# Altium schematic sheet 八路btn驱动.SchDoc
size A2
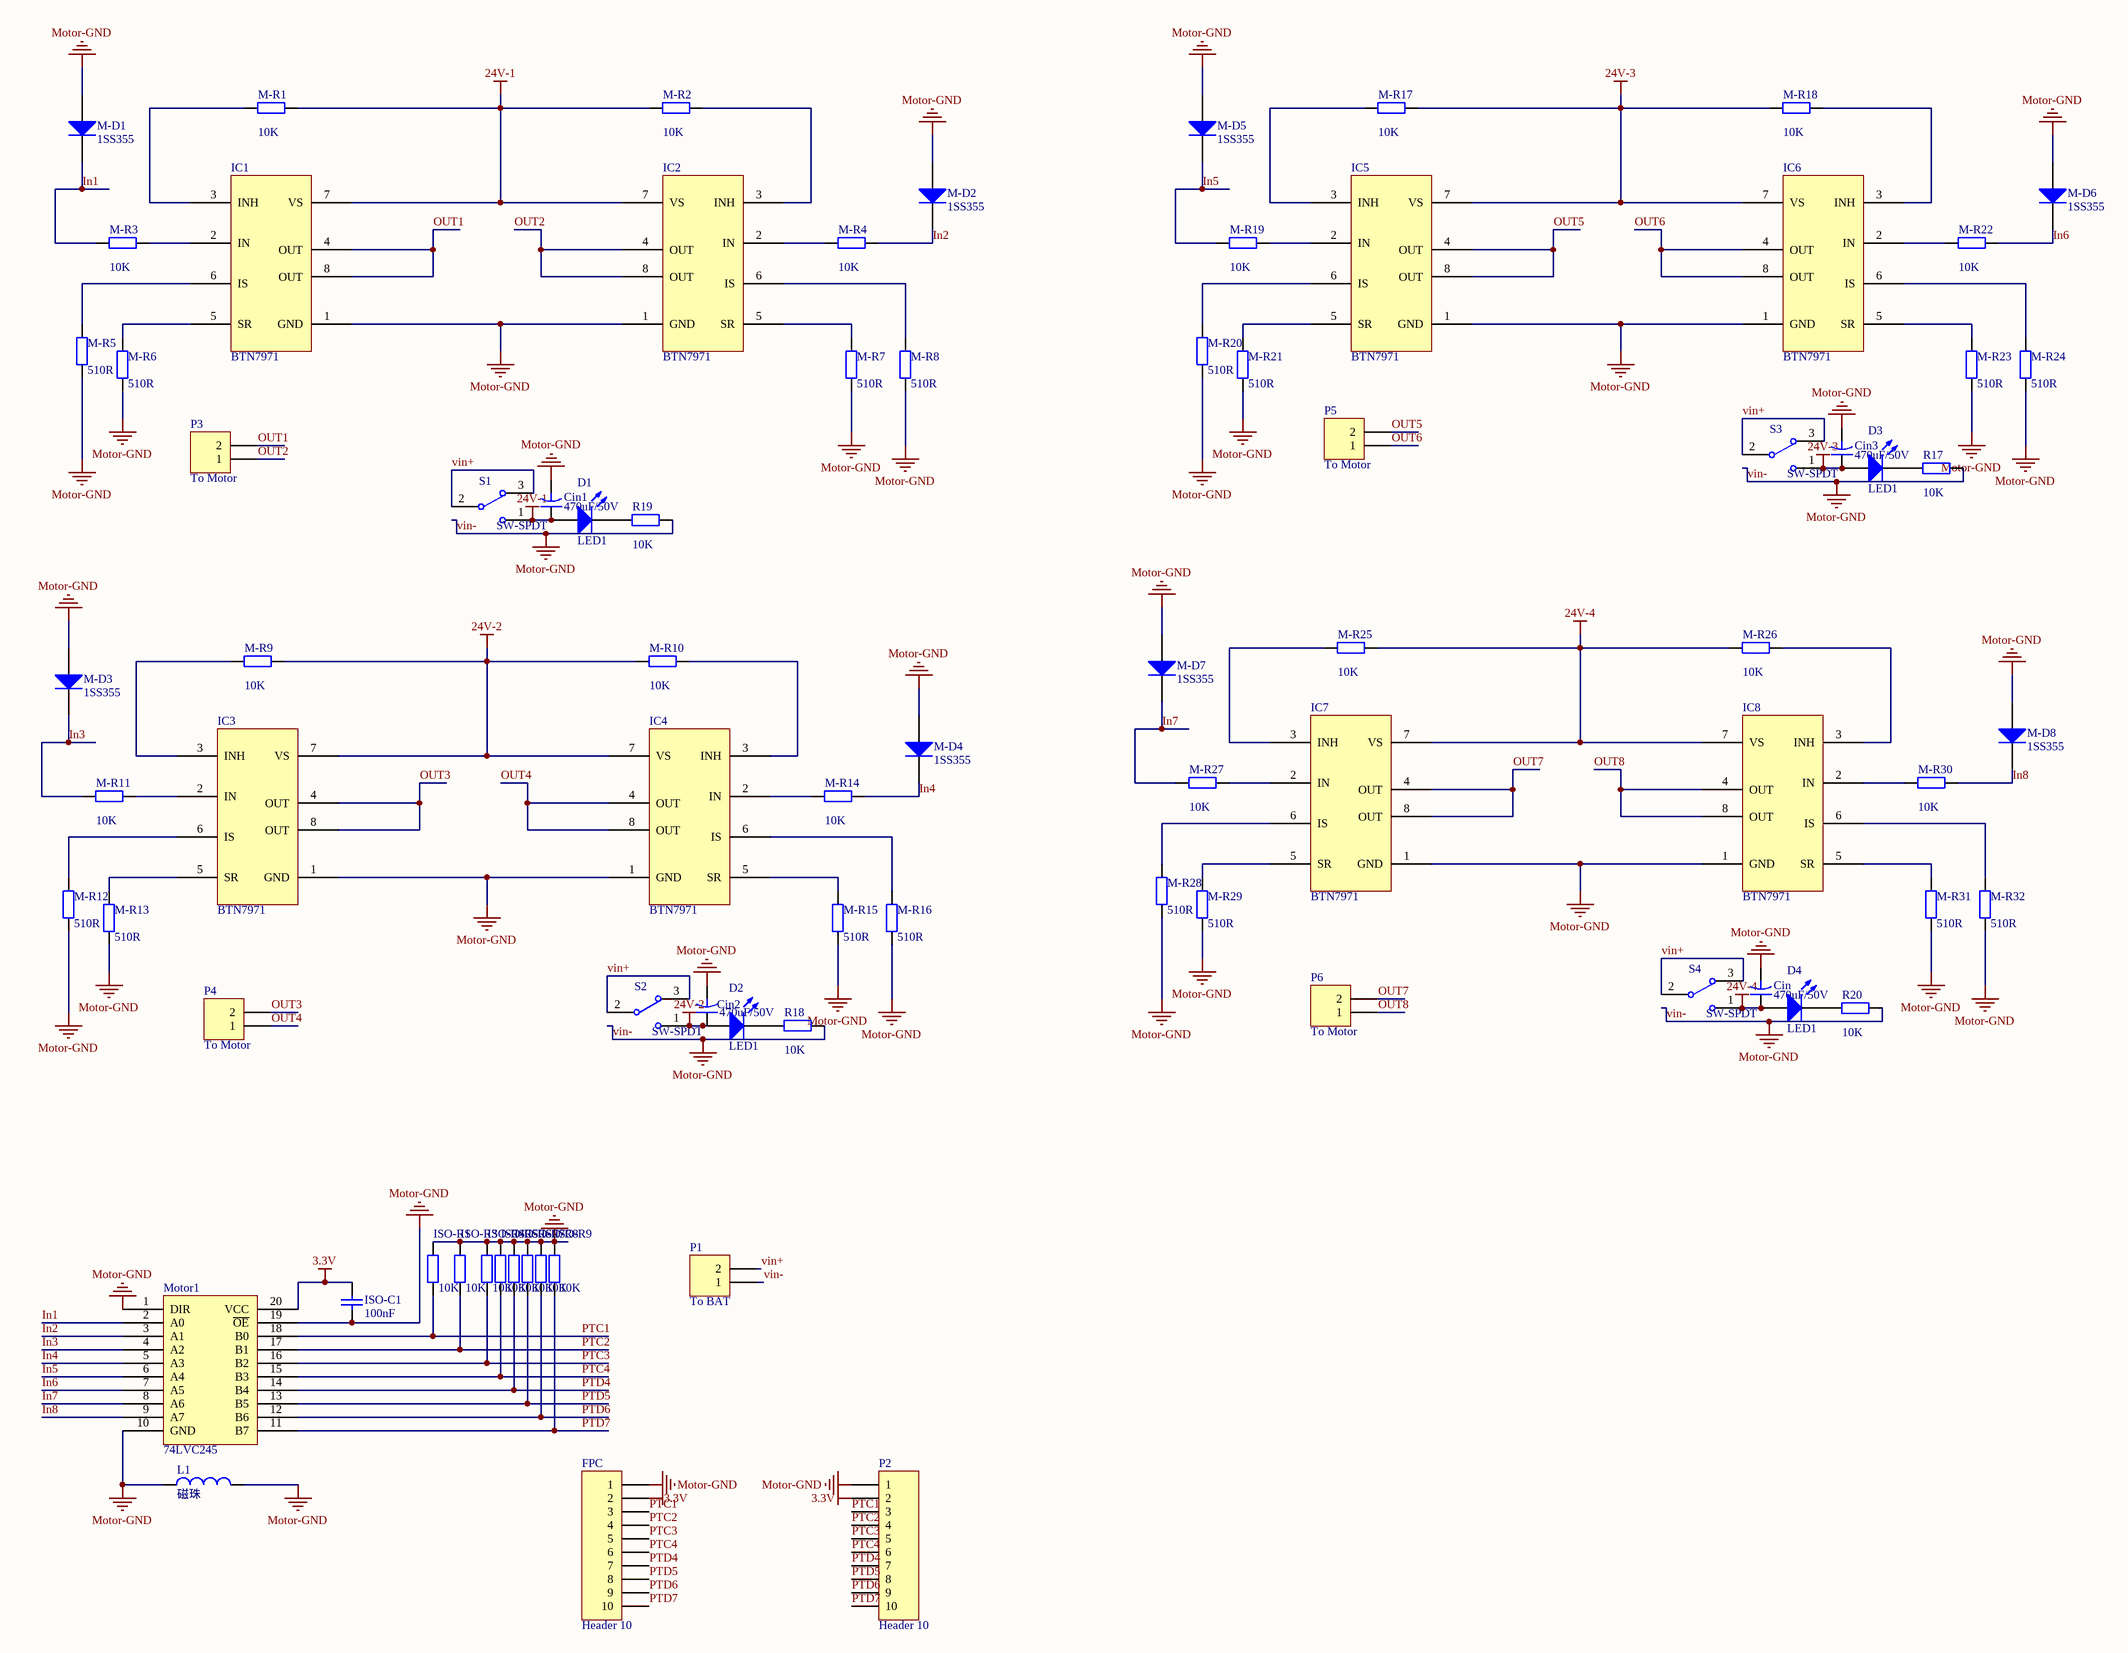
[diagram p0: 八路btn驱动.SchDoc]

## Parts
Cin  value 470uF/50V  [RB.2(10mm)]  (hidden comment: Cap2)
Cin1  value 470uF/50V  [RB.2(10mm)]  (hidden comment: Cap2)
Cin2  value 470uF/50V  [RB.2(10mm)]  (hidden comment: Cap2)
Cin3  value 470uF/50V  [RB.2(10mm)]  (hidden comment: Cap2)
D1  LED1  [LED0805G]
D2  LED1  [LED0805G]
D3  LED1  [LED0805G]
D4  LED1  [LED0805G]
FPC  Header 10  [HDR2X5]
IC1  BTN7971  [PG-TO263-7-1]
IC2  BTN7971  [PG-TO263-7-1]
IC3  BTN7971  [PG-TO263-7-1]
IC4  BTN7971  [PG-TO263-7-1]
IC5  BTN7971  [PG-TO263-7-1]
IC6  BTN7971  [PG-TO263-7-1]
IC7  BTN7971  [PG-TO263-7-1]
IC8  BTN7971  [PG-TO263-7-1]
ISO-C1  100nF  [c0805]
ISO-R1  value 10K  [c0805]  (hidden comment: Res2)
ISO-R3  value 10K  [c0805]  (hidden comment: Res2)
ISO-R4  value 10K  [c0805]  (hidden comment: Res2)
ISO-R5  value 10K  [c0805]  (hidden comment: Res2)
ISO-R6  value 10K  [c0805]  (hidden comment: Res2)
ISO-R7  value 10K  [c0805]  (hidden comment: Res2)
ISO-R8  value 10K  [c0805]  (hidden comment: Res2)
ISO-R9  value 10K  [c0805]  (hidden comment: Res2)
L1  磁珠  [c0805]
M-D1  1SS355  [SMB]
M-D2  1SS355  [SMB]
M-D3  1SS355  [SMB]
M-D4  1SS355  [SMB]
M-D5  1SS355  [SMB]
M-D6  1SS355  [SMB]
M-D7  1SS355  [SMB]
M-D8  1SS355  [SMB]
M-R1  value 10K  [0805]  (hidden comment: Res2)
M-R2  value 10K  [0805]  (hidden comment: Res2)
M-R3  value 10K  [0805]  (hidden comment: Res2)
M-R4  value 10K  [0805]  (hidden comment: Res2)
M-R5  value 510R  [0805]  (hidden comment: Res2)
M-R6  value 510R  [0805]  (hidden comment: Res2)
M-R7  value 510R  [0805]  (hidden comment: Res2)
M-R8  value 510R  [0805]  (hidden comment: Res2)
M-R9  value 10K  [0805]  (hidden comment: Res2)
M-R10  value 10K  [0805]  (hidden comment: Res2)
M-R11  value 10K  [0805]  (hidden comment: Res2)
M-R12  value 510R  [0805]  (hidden comment: Res2)
M-R13  value 510R  [0805]  (hidden comment: Res2)
M-R14  value 10K  [0805]  (hidden comment: Res2)
M-R15  value 510R  [0805]  (hidden comment: Res2)
M-R16  value 510R  [0805]  (hidden comment: Res2)
M-R17  value 10K  [0805]  (hidden comment: Res2)
M-R18  value 10K  [0805]  (hidden comment: Res2)
M-R19  value 10K  [0805]  (hidden comment: Res2)
M-R20  value 510R  [0805]  (hidden comment: Res2)
M-R21  value 510R  [0805]  (hidden comment: Res2)
M-R22  value 10K  [0805]  (hidden comment: Res2)
M-R23  value 510R  [0805]  (hidden comment: Res2)
M-R24  value 510R  [0805]  (hidden comment: Res2)
M-R25  value 10K  [0805]  (hidden comment: Res2)
M-R26  value 10K  [0805]  (hidden comment: Res2)
M-R27  value 10K  [0805]  (hidden comment: Res2)
M-R28  value 510R  [0805]  (hidden comment: Res2)
M-R29  value 510R  [0805]  (hidden comment: Res2)
M-R30  value 10K  [0805]  (hidden comment: Res2)
M-R31  value 510R  [0805]  (hidden comment: Res2)
M-R32  value 510R  [0805]  (hidden comment: Res2)
Motor1  74LVC245  [TSSOP20]
P1  To BAT  [0.5mm端子]
P2  Header 10  [FH12-10S-1SH]
P3  To Motor  [0.5mm端子]
P4  To Motor  [0.5mm端子]
P5  To Motor  [0.5mm端子]
P6  To Motor  [0.5mm端子]
R17  value 10K  [R0805]
R18  value 10K  [R0805]
R19  value 10K  [R0805]
R20  value 10K  [R0805]
S1  SW-SPDT  [switch]
S2  SW-SPDT  [switch]
S3  SW-SPDT  [switch]
S4  SW-SPDT  [switch]

## Nets
3.3V: FPC.2 ISO-C1.1 Motor1.20(VCC) P2.2
24V-1: Cin1.1 D1.1(A) IC1.7(VS) IC2.7(VS) M-R1.2 M-R2.1 S1.1
24V-2: Cin2.1 D2.1(A) IC3.7(VS) IC4.7(VS) M-R9.2 M-R10.1 S2.1
24V-3: Cin3.1 D3.1(A) IC5.7(VS) IC6.7(VS) M-R17.2 M-R18.1 S3.1
24V-4: Cin.1 D4.1(A) IC7.7(VS) IC8.7(VS) M-R25.2 M-R26.1 S4.1
vin-: Cin.2 Cin1.2 Cin2.2 Cin3.2 FPC.1 IC1.1(GND) IC2.1(GND) IC3.1(GND) IC4.1(GND) IC5.1(GND) IC6.1(GND) IC7.1(GND) IC8.1(GND) ISO-C1.2 ISO-R1.2 ISO-R3.2 ISO-R4.2 ISO-R5.2 ISO-R6.2 ISO-R7.2 ISO-R8.2 ISO-R9.2 L1.1 L1.2 M-D1.1(A) M-D2.1(A) M-D3.1(A) M-D4.1(A) M-D5.1(A) M-D6.1(A) M-D7.1(A) M-D8.1(A) M-R5.1 M-R6.1 M-R7.1 M-R8.1 M-R12.1 M-R13.1 M-R15.1 M-R16.1 M-R20.1 M-R21.1 M-R23.1 M-R24.1 M-R28.1 M-R29.1 M-R31.1 M-R32.1 Motor1.1(DIR) Motor1.10(GND) Motor1.19(~{OE}) P1.1 P2.1 R17.1 R18.1 R19.1 R20.1  [also labelled Motor-GND]
In1: M-D1.2(K) M-R3.1 Motor1.2(A0)
In2: M-D2.2(K) M-R4.2 Motor1.3(A1)
In3: M-D3.2(K) M-R11.1 Motor1.4(A2)
In4: M-D4.2(K) M-R14.2 Motor1.5(A3)
In5: M-D5.2(K) M-R19.1 Motor1.6(A4)
In6: M-D6.2(K) M-R22.2 Motor1.7(A5)
In7: M-D7.2(K) M-R27.1 Motor1.8(A6)
In8: M-D8.2(K) M-R30.2 Motor1.9(A7)
OUT1: IC1.4(OUT) IC1.8(OUT) P3.2
OUT2: IC2.4(OUT) IC2.8(OUT) P3.1
OUT3: IC3.4(OUT) IC3.8(OUT) P4.2
OUT4: IC4.4(OUT) IC4.8(OUT) P4.1
OUT5: IC5.4(OUT) IC5.8(OUT) P5.2
OUT6: IC6.4(OUT) IC6.8(OUT) P5.1
OUT7: IC7.4(OUT) IC7.8(OUT) P6.2
OUT8: IC8.4(OUT) IC8.8(OUT) P6.1
PTC1: FPC.3 ISO-R1.1 Motor1.18(B0) P2.3
PTC2: FPC.4 ISO-R3.1 Motor1.17(B1) P2.4
PTC3: FPC.5 ISO-R4.1 Motor1.16(B2) P2.5
PTC4: FPC.6 ISO-R5.1 Motor1.15(B3) P2.6
PTD4: FPC.7 ISO-R6.1 Motor1.14(B4) P2.7
PTD5: FPC.8 ISO-R7.1 Motor1.13(B5) P2.8
PTD6: FPC.9 ISO-R8.1 Motor1.12(B6) P2.9
PTD7: FPC.10 ISO-R9.1 Motor1.11(B7) P2.10
vin+: P1.2 S1.2 S1.3 S2.2 S2.3 S3.2 S3.3 S4.2 S4.3
NetD1_2: D1.2(K) R19.2
NetD2_2: D2.2(K) R18.2
NetD3_2: D3.2(K) R17.2
NetD4_2: D4.2(K) R20.2
NetIC1_2: IC1.2(IN) M-R3.2
NetIC1_3: IC1.3(INH) M-R1.1
NetIC1_5: IC1.5(SR) M-R6.2
NetIC1_6: IC1.6(IS) M-R5.2
NetIC2_2: IC2.2(IN) M-R4.1
NetIC2_3: IC2.3(INH) M-R2.2
NetIC2_5: IC2.5(SR) M-R7.2
NetIC2_6: IC2.6(IS) M-R8.2
NetIC3_2: IC3.2(IN) M-R11.2
NetIC3_3: IC3.3(INH) M-R9.1
NetIC3_5: IC3.5(SR) M-R13.2
NetIC3_6: IC3.6(IS) M-R12.2
NetIC4_2: IC4.2(IN) M-R14.1
NetIC4_3: IC4.3(INH) M-R10.2
NetIC4_5: IC4.5(SR) M-R15.2
NetIC4_6: IC4.6(IS) M-R16.2
NetIC5_2: IC5.2(IN) M-R19.2
NetIC5_3: IC5.3(INH) M-R17.1
NetIC5_5: IC5.5(SR) M-R21.2
NetIC5_6: IC5.6(IS) M-R20.2
NetIC6_2: IC6.2(IN) M-R22.1
NetIC6_3: IC6.3(INH) M-R18.2
NetIC6_5: IC6.5(SR) M-R23.2
NetIC6_6: IC6.6(IS) M-R24.2
NetIC7_2: IC7.2(IN) M-R27.2
NetIC7_3: IC7.3(INH) M-R25.1
NetIC7_5: IC7.5(SR) M-R29.2
NetIC7_6: IC7.6(IS) M-R28.2
NetIC8_2: IC8.2(IN) M-R30.1
NetIC8_3: IC8.3(INH) M-R26.2
NetIC8_5: IC8.5(SR) M-R31.2
NetIC8_6: IC8.6(IS) M-R32.2

## Notes on the sheet
- Title
- Size:
- Date:
- File:
- A2
- Number:
- Time:
- Revision:
- Sheet
- of

## Library data of the parts
Cin Cin1-Cin3 = Cap2: Capacitor; Published: 23-Sep-2002; PackageReference: CAPR5-4X5; Publisher: Altium Limited
D1-D4 = LED1: Typical RED GaAs LED; Published: 8-Jun-2000; LatestRevisionDate: 08-Jul-2005; LatestRevisionNote: Mech Layer 1 removed.; PackageReference: LED-1; Publisher: Altium Limited
FPC P2 = Header 10: Header, 10-Pin; LatestRevisionDate: 17-Jul-2002; LatestRevisionNote: Re-released for DXP Platform.; Publisher: Altium Limited
IC1-IC8 = BTN7960
ISO-C1 = Cap: Capacitor
ISO-R1 ISO-R3-ISO-R9 M-R1-M-R32 R17-R20 = Res2: Resistor; Published: 8-Jun-2000; LatestRevisionDate: 17-Jul-2002; LatestRevisionNote: Re-released for DXP Platform.; PackageReference: AXIAL-0.4; Publisher: Altium Limited
  ISO-R1 ISO-R3-ISO-R9 M-R1-M-R32: PackageDescription: Axial Device, Thru-Hole; 2 Leads; 0.4 in Pin Spacing
L1 = Inductor: Code_IEC: 1005; Value: 10mH; Published: 8-Jun-2000; LatestRevisionDate: 17-Jul-2002; LatestRevisionNote: Re-released for DXP Platform.; PackageReference: 0402-A; Publisher: Altium Limited; Code_JEITA: 0402
M-D1-M-D8 = Diode 1N4148: High Conductance Fast Diode; LatestRevisionDate: 17-Jul-2002; LatestRevisionNote: Re-released for DXP Platform.; DatasheetDocument: 1997; PackageReference: DO-35; Publisher: Altium Limited; Code_JEDEC: DO-204-AH; ComponentLink1Description: Manufacturer Link; ComponentLink2Description: Datasheet; ComponentLink2URL: http://www.fairchildsemi.com/ds/1N%2F1N4148.pdf
P1 P3-P6 = Header 2: Header, 2-Pin; LatestRevisionDate: 17-Jul-2002; LatestRevisionNote: Re-released for DXP Platform.; Publisher: Altium Limited
S1-S4 = SW-SPDT: SPDT Subminiature Toggle Switch, Right Angle Mounting, Vertical Actuation; Published: 24-Mar-1999; LatestRevisionDate: 17-Dec-2003; LatestRevisionNote: Schematic revised, PCB Footprint replaced.; DatasheetDocument: 05-Dec-2000; PackageReference: TL36WW15050; Publisher: Altium Limited; ComponentLink1Description: Manufacturer Link; ComponentLink1URL: http://www.apem.com